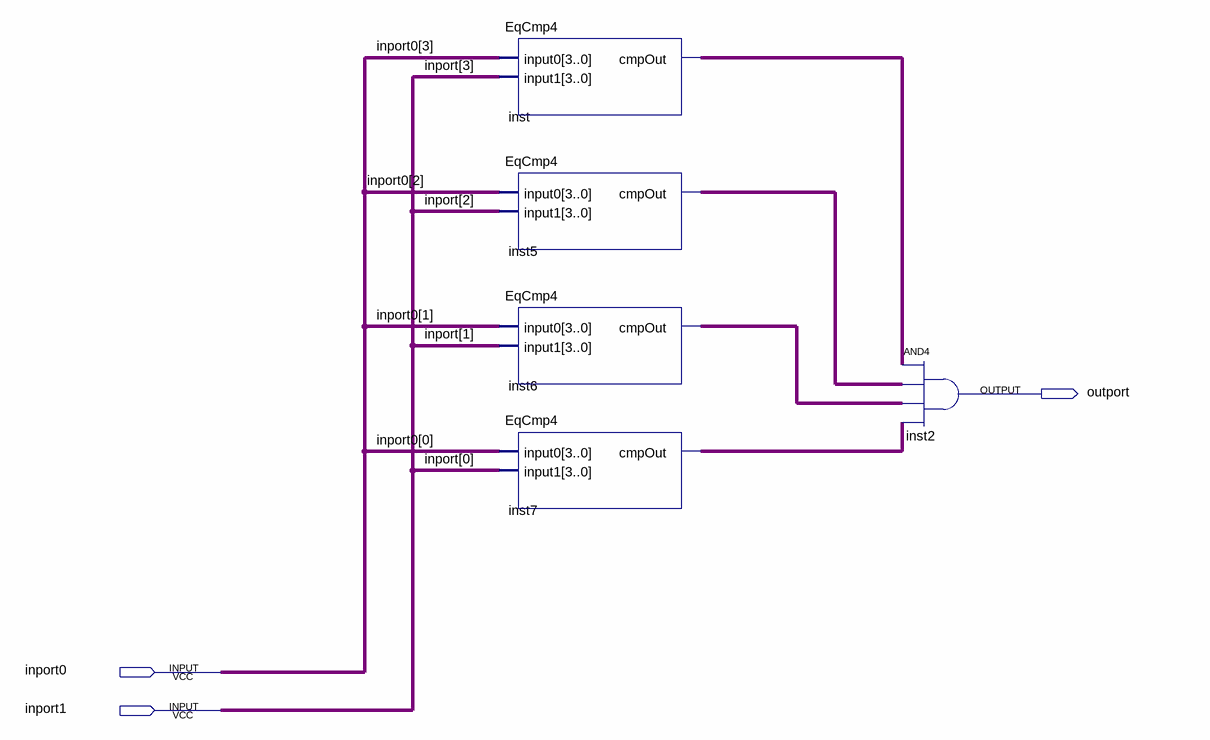
[diagram p0: schematic sheet]
// Quartus schematic EqCmp4_2.bdf as structural Verilog: 5 symbols, 3 pins
module EqCmp4_2 (
  input  inport0,
  input  inport1,
  output outport
);

  wire inst5_cmpout, inst6_cmpout, inst7_cmpout, inst_cmpout;
  wire [3:0] inport0_bus;
  wire [3:2] inport;

  EqCmp4 inst (.input0({4{inport0_bus[3]}}), .input1({4{inport[3]}}), .cmpOut(inst_cmpout));
  EqCmp4 inst5 (.input0({4{inport0_bus[2]}}), .input1({4{inport[2]}}), .cmpOut(inst5_cmpout));
  EqCmp4 inst6 (.input0({4{inport0_bus[1]}}), .input1({4{inport1}}), .cmpOut(inst6_cmpout));
  EqCmp4 inst7 (.input0({4{inport0_bus[0]}}), .input1({4{inport0}}), .cmpOut(inst7_cmpout));
  and inst2 (outport, inst_cmpout, inst5_cmpout, inst6_cmpout, inst7_cmpout);
endmodule
